# Altium schematic sheet FTDI.SchDoc
size A4
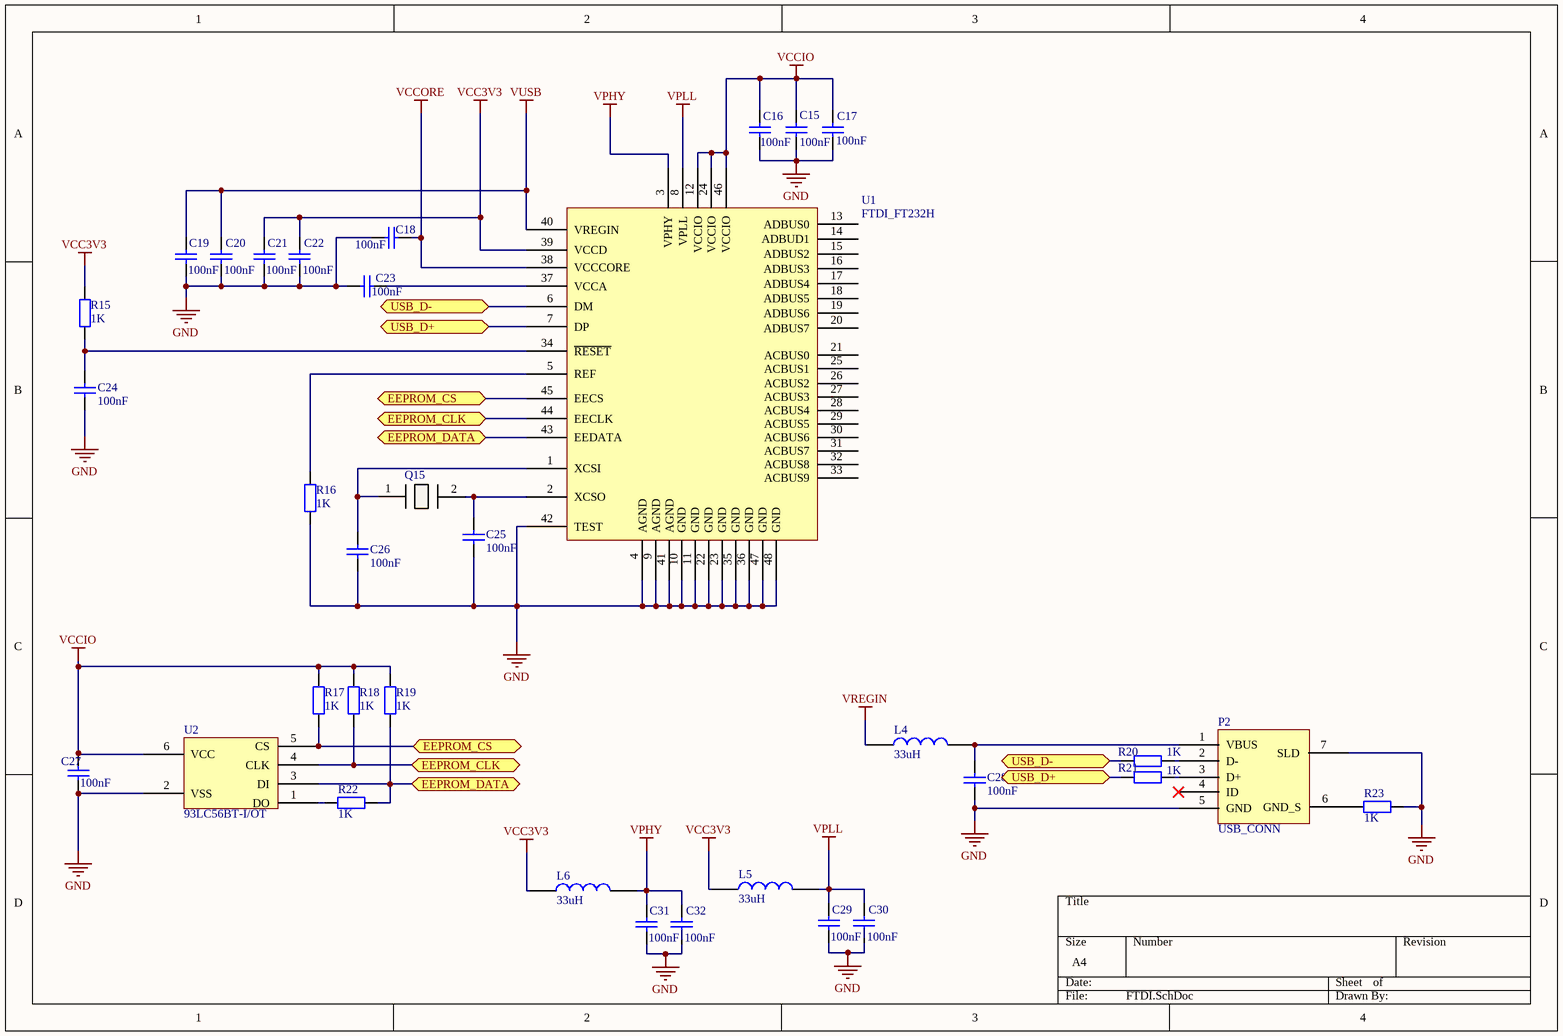
[diagram p0: FTDI.SchDoc]

## Parts
C15  100nF  [AXIAL-0.3]
C16  100nF  [AXIAL-0.3]
C17  100nF  [AXIAL-0.3]
C18  100nF  [AXIAL-0.3]
C19  100nF  [AXIAL-0.3]
C20  100nF  [AXIAL-0.3]
C21  100nF  [AXIAL-0.3]
C22  100nF  [AXIAL-0.3]
C23  100nF  [AXIAL-0.3]
C24  100nF  [AXIAL-0.3]
C25  100nF  [AXIAL-0.3]
C26  100nF  [AXIAL-0.3]
C27  100nF  [AXIAL-0.3]
C28  100nF  [AXIAL-0.3]
C29  100nF  [AXIAL-0.3]
C30  100nF  [AXIAL-0.3]
C31  100nF  [AXIAL-0.3]
C32  100nF  [AXIAL-0.3]
L4  33uH  [AXIAL-0.3]
L5  33uH  [AXIAL-0.3]
L6  33uH  [AXIAL-0.3]
P2  USB_CONN  [SMD_Micro_USB]
Q15  HC49/4HSMX  [Crystal_10MHz]  (value not drawn)
R15  1K  [AXIAL-0.3]
R16  1K  [AXIAL-0.3]
R17  1K  [AXIAL-0.3]
R18  1K  [AXIAL-0.3]
R19  1K  [AXIAL-0.3]
R20  1K  [AXIAL-0.3]
R21  1K  [AXIAL-0.3]
R22  1K  [AXIAL-0.3]
R23  1K  [AXIAL-0.3]
U1  FTDI_FT232H  [LQFP48]
U2  93LC56BT-I/OT  [SOT-23]

## Ports
EEPROM_CLK, EEPROM_CS, EEPROM_DATA, USB_D+, USB_D-

## Nets
GND: C15.1 C16.1 C17.1 C18.1 C19.1 C20.1 C21.1 C22.1 C23.2 C24.1 C25.1 C26.1 C27.1 C28.1 C29.1 C30.1 C31.1 C32.1 P2.5(GND) P2.7(SLD) R16.1 R23.2 U1.4(AGND) U1.9(AGND) U1.10(GND) U1.11(GND) U1.22(GND) U1.23(GND) U1.35(GND) U1.36(GND) U1.41(AGND) U1.42(TEST) U1.47(GND) U1.48(GND) U2.2(VSS)
VCC3V3: C21.2 C22.2 L5.1 L6.1 R15.2 U1.39(VCCD)
VCCIO: C15.2 C16.2 C17.2 C27.2 R17.2 R18.2 R19.2 U1.12(VCCIO) U1.24(VCCIO) U1.46(VCCIO) U2.6(VCC)
VCCORE: C18.2 U1.38(VCCCORE)
VPHY: C31.2 C32.2 L6.2 U1.3(VPHY)
VPLL: C29.2 C30.2 L5.2 U1.8(VPLL)
VREGIN: L4.1
VUSB: C19.2 C20.2 U1.40(VREGIN)
EEPROM_CLK: R18.1 U1.44(EECLK) U2.4(CLK) ; port EEPROM_CLK
EEPROM_CS: R17.1 U1.45(EECS) U2.5(CS) ; port EEPROM_CS
EEPROM_DATA: R19.1 R22.2 U1.43(EEDATA) U2.3(DI) ; port EEPROM_DATA
USB_D+: R21.1 U1.7(DP) ; port USB_D+
USB_D-: R20.1 U1.6(DM) ; port USB_D-
NetC23_1: C23.1 U1.37(VCCA)
NetC24_2: C24.2 R15.1 U1.34(~{RE}~{SET})
NetC25_2: C25.2 Q15.2(X2) U1.2(XCSO)
NetC26_2: C26.2 Q15.1(X1) U1.1(XCSI)
NetC28_2: C28.2 L4.2 P2.1(VBUS)
NetP2_2: P2.2(D-) R20.2
NetP2_3: P2.3(D+) R21.2
NetP2_6: P2.6(GND_S) R23.1
NetR16_2: R16.2 U1.5(REF)
NetR22_1: R22.1 U2.1(DO)

Not connected (* = marked no-connect by the designer): P2 4(ID)*; U1 13(ADBUS0) 14(ADBUD1) 15(ADBUS2) 16(ADBUS3) 17(ADBUS4) 18(ADBUS5) 19(ADBUS6) 20(ADBUS7) 21(ACBUS0) 25(ACBUS1) 26(ACBUS2) 27(ACBUS3) 28(ACBUS4) 29(ACBUS5) 30(ACBUS6) 31(ACBUS7) 32(ACBUS8) 33(ACBUS9)

## Library data of the parts
C15-C32 = CAP: Capacitor; Value: 100nF
L4-L6 = IND: Inductor; Value: 33uH
P2 = USB_connector: usb, smd csatlakozó
Q15 = HC49/4HSMX: kristály
R15-R23 = RES: Resistor; Value: 1K
U1 = FTDI_FT232H: USB transciever
U2 = 93LC56BT-I/OT: EEPROM